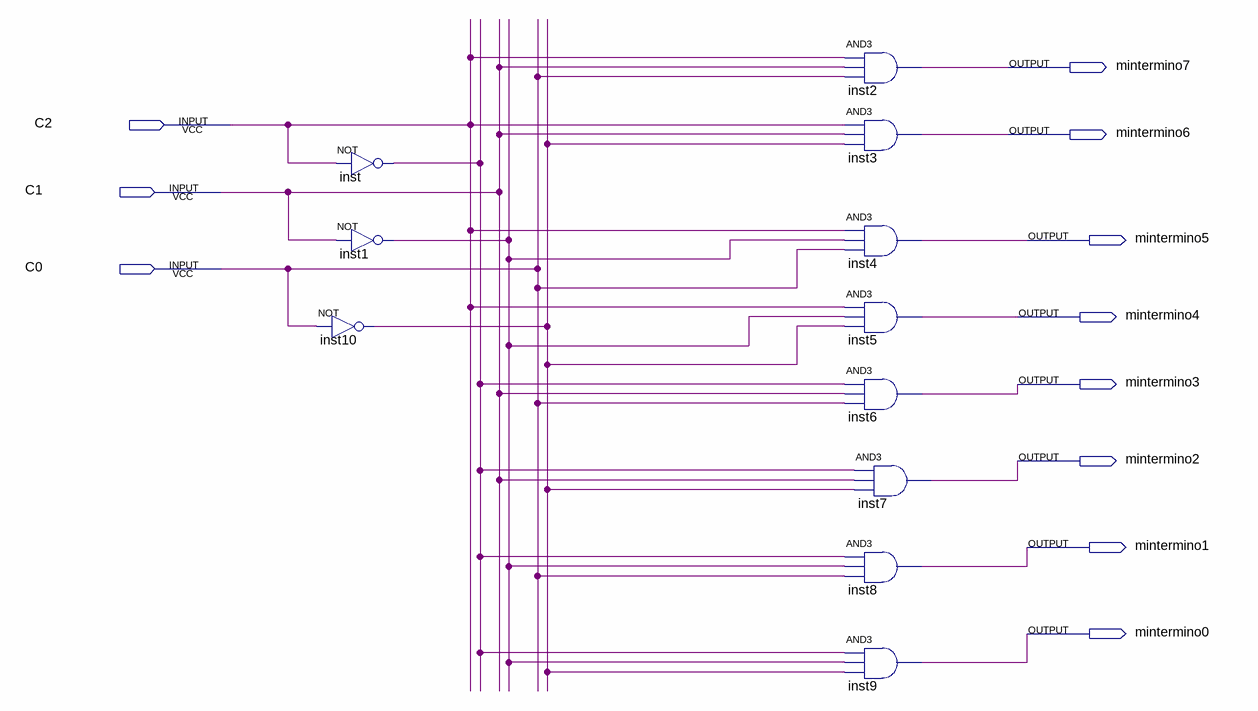
[diagram p0: schematic sheet]
// Quartus schematic miniterminos_8.bdf as structural Verilog: 11 symbols, 11 pins
module miniterminos_8 (
  input  C2,
  input  C1,
  input  C0,
  output mintermino7,
  output mintermino6,
  output mintermino5,
  output mintermino4,
  output mintermino3,
  output mintermino2,
  output mintermino1,
  output mintermino0
);

  wire inst1_out, inst10_out, inst_out;

  not inst10 (inst10_out, C0);
  not inst (inst_out, C2);
  not inst1 (inst1_out, C1);
  and inst2 (mintermino7, C2, C1, C0);
  and inst3 (mintermino6, C2, C1, inst10_out);
  and inst4 (mintermino5, C2, inst1_out, C0);
  and inst5 (mintermino4, C2, inst1_out, inst10_out);
  and inst6 (mintermino3, inst_out, C1, C0);
  and inst7 (mintermino2, inst_out, C1, inst10_out);
  and inst8 (mintermino1, inst_out, inst1_out, C0);
  and inst9 (mintermino0, inst_out, inst1_out, inst10_out);
endmodule
